# EAGLE schematic Arduino-UNO-Sheild (EAGLE 7.3.0)
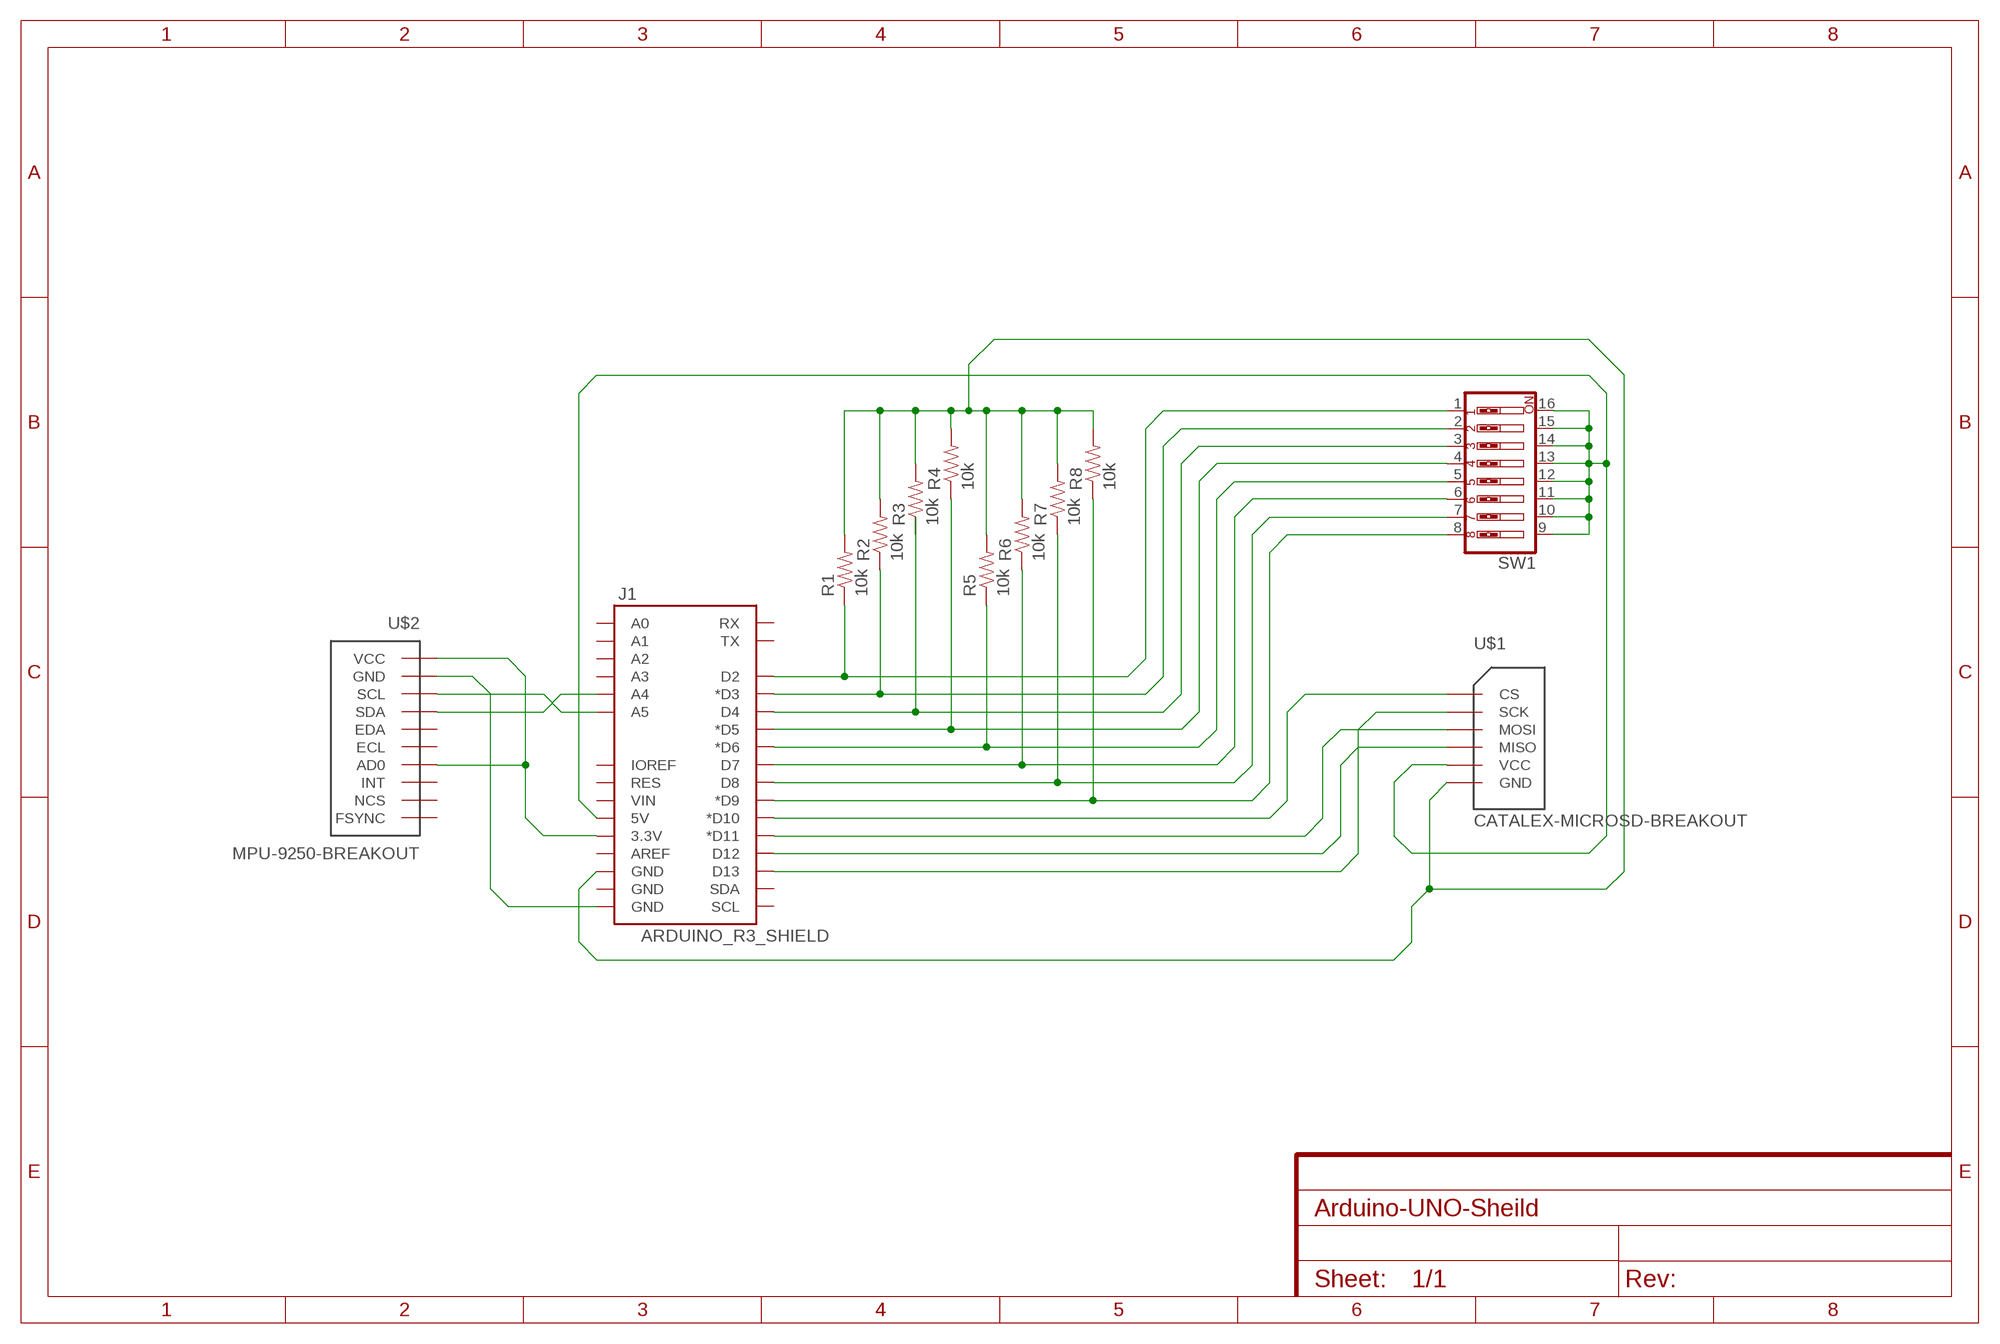
[diagram p0: schematic, sheet 1]
FRAME1 (FRAME-A4L): CNAME: Arduino UNO Prototype Sheild; CREVISION: 2; DESIGNER: Prashant Sinha

## Parts
J1  ARDUINO_R3_SHIELD  [UNO_R3_SHIELD]
R1  10k  RESISTORKIT  [AXIAL-0.3-KIT]
R2  10k  RESISTORKIT  [AXIAL-0.3-KIT]
R3  10k  RESISTORKIT  [AXIAL-0.3-KIT]
R4  10k  RESISTORKIT  [AXIAL-0.3-KIT]
R5  10k  RESISTORKIT  [AXIAL-0.3-KIT]
R6  10k  RESISTORKIT  [AXIAL-0.3-KIT]
R7  10k  RESISTORKIT  [AXIAL-0.3-KIT]
R8  10k  RESISTORKIT  [AXIAL-0.3-KIT]
SW1  SW_DIP-8  [DIPSWITCH-08]
U$1  CATALEX-MICROSD-BREAKOUT  [CATALEX-MICROSD-BREAKOUT]
U$2  MPU-9250-BREAKOUT  [MPU-9250-BREAKOUT]

## Nets
N$1: J1.A4 U$2.SDA
N$2: J1.A5 U$2.SCL
N$3: J1.3.3V U$2.AD0 U$2.VCC
N$4: J1.GND@0(GND) U$2.GND
N$5: J1.D11(*D11) U$1.MOSI
N$6: J1.D12 U$1.MISO
N$7: J1.D13 U$1.SCK
N$8: J1.D10(*D10) U$1.CS
N$9: J1.D2 R1.P$1 SW1.1
N$10: J1.D3(*D3) R2.P$1 SW1.2
N$11: J1.D4 SW1.3
N$12: J1.D5(*D5) R4.P$1 SW1.4
N$13: J1.D6(*D6) R5.P$1 SW1.5
N$14: J1.D7 R6.P$1 SW1.6
N$15: J1.D8 R7.P$1 SW1.7
N$16: J1.D9(*D9) R8.P$1 SW1.8
N$18: J1.5V SW1.9 SW1.10 SW1.11 SW1.12 SW1.13 SW1.14 SW1.15 SW1.16 U$1.VCC
N$19: J1.GND@2(GND) R1.P$2 R2.P$2 R3.P$2 R4.P$2 R5.P$2 R6.P$2 R7.P$2 R8.P$2 U$1.GND
Unconnected: J1.A0 J1.A1 J1.A2 J1.A3 J1.AREF J1.GND@1(GND) J1.IOREF J1.RES J1.RX J1.SCL J1.SDA J1.TX J1.VIN R3.P$1 U$2.ECL U$2.EDA U$2.FSYNC U$2.INT U$2.NCS

## Library data of the parts
J1 = SparkFun-Boards:ARDUINO_R3_SHIELD: Shield form compatible with the Arduino Uno R3.
R1-R8 = SparkFun-Passives:RESISTOR: Resistor Basic schematic elements and footprints for 0603, 1206, and PTH resistors.
SW1 = SparkFun-Electromechanical:SW_DIP-8: DIP Switch 8 Position
U$1 = Modules:CATALEX-MICROSD-BREAKOUT
U$2 = Modules:MPU-9250-BREAKOUT: MPU-9250 is an IMU (Inertial Measurement Unit) having 9 DoF axes. This is a breakout board for Arduino.